# Altium schematic sheet Thermokoppel.SchDoc: Thermokoppel
size A4; DrawnBy: Loic Schillings; Revision: 1; SheetNumber: 1; SheetTotal: 5
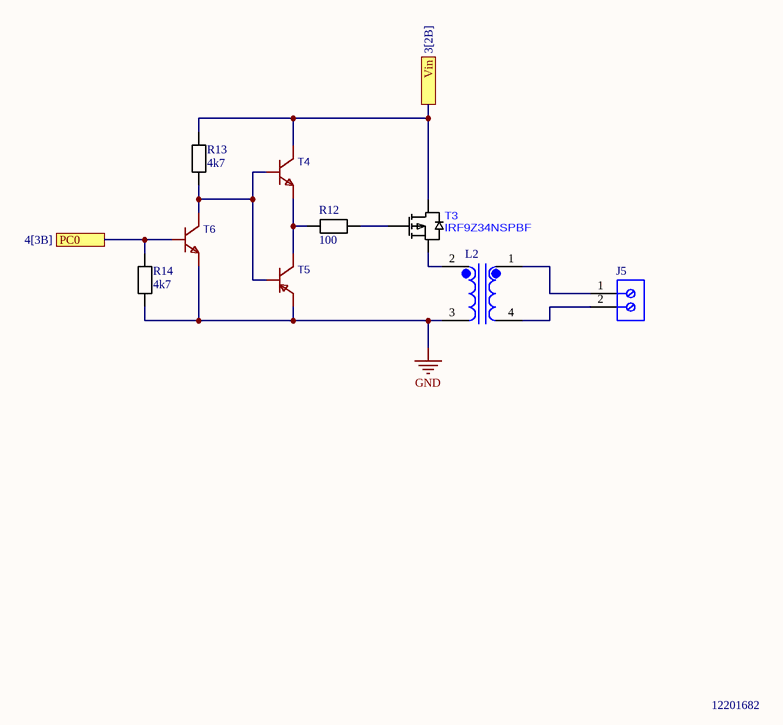
[diagram p0: Thermokoppel.SchDoc]

## Parts
J5  691214110002  [2 Screw Terminal WE 691214110002]  (value not drawn)
L2  CM2545X171B-10  [CM2545X171B-10]  (value not drawn)
R12  100  [R0805]
R13  4k7  [R0805]
R14  4k7  [R0805]
T3  IRF9Z34NSPBF  [IRF9Z34NSPBF]
T4  BC847C_C3027113  [BC847_PNP]  (value not drawn)
T5  BC857 3G  [BC847C_NPN]  (value not drawn)
T6  BC847C_C3027113  [BC847_PNP]  (value not drawn)

## Ports
PC0 (see 4[3B]), Vin (see 3[2B])

## Nets
GND: L2.3 R14.1 T5.2 T6.2(E)
PC0: R14.2 T6.1(B) ; port PC0
Vin: R13.2 T3.2(D) T4.3(C) ; port Vin
NetJ5_1: J5.1 L2.1
NetJ5_2: J5.2 L2.4
NetL2_2: L2.2 T3.3(S)
NetR12_1: R12.1 T4.2(E) T5.3
NetR12_2: R12.2 T3.4
NetR13_1: R13.1 T4.1(B) T5.1 T6.3(C)

## Notes on the sheet
- 12201682

## Library data of the parts
J5 = 2 Screw Terminal WE 691214110002: Serie 2141 - 3.50 mm Horizontal Entry Modular with Rising Cage Clamp WR-TBL, 2 pin; Manufacturer: Wurth Elektronik; Pin Number: 2; Pitch: 3.50mm; Datasheet URL: http://katalog.we-online.de/em/datasheet/6912141100xx.pdf; Packaging: Box; Mounting Technology: THT; Package Reference: 691214110002; Manufacturer URL: http://www.we-online.de; Part Number: 691214110002; Publisher: WurthElektronik; Operating Temperature: -40to105degC
L2 = CM2545X171B-10: 2 Line Common Mode Choke Through Hole 170 Ohms @ 100 MHz 10A DCR 10mOhm; MF: Laird; Value: *; Purchase-URL: https://pricing.snapeda.com/search/part/CM2545X171B-10/?ref=eda; Price: None; Package: Vertical-4 Laird; SnapEDA_Link: https://www.snapeda.com/parts/CM2545X171B-10/Laird/view-part/?ref=snap; Availability: In Stock; Check_prices: https://www.snapeda.com/parts/CM2545X171B-10/Laird/view-part/?ref=eda; MP: CM2545X171B-10
R12-R14 = Resistor: Manufacturer: Vishay Dale; Part Number: CRCW08050000Z0EA
T4 T6 = BC847C_NPN: BOM_Manufacturer: SALLTECH(萨瑞); BOM_Manufacturer Part: BC847C; Contributor: lcsc; BOM_Supplier: LCSC; BOM_Supplier Part: C3027113; link: https://atta.szlcsc.com/upload/public/pdf/source/20220824/287706FC7904CA05889B348536529CCD.pdf; BOM_JLCPCB Part Class: Extended Part; spicePre: Q; spiceSymbolName: BC847C_C3027113
T5 = BC847_PNP: BOM_Manufacturer: CJ(江苏长电/长晶); BOM_Supplier: LCSC; BOM_Manufacturer Part: BC857; BOM_Supplier Part: C2139; BOM_JLCPCB Part Class: Extended Part; spicePre: Q; spiceSymbolName: BC857 3G